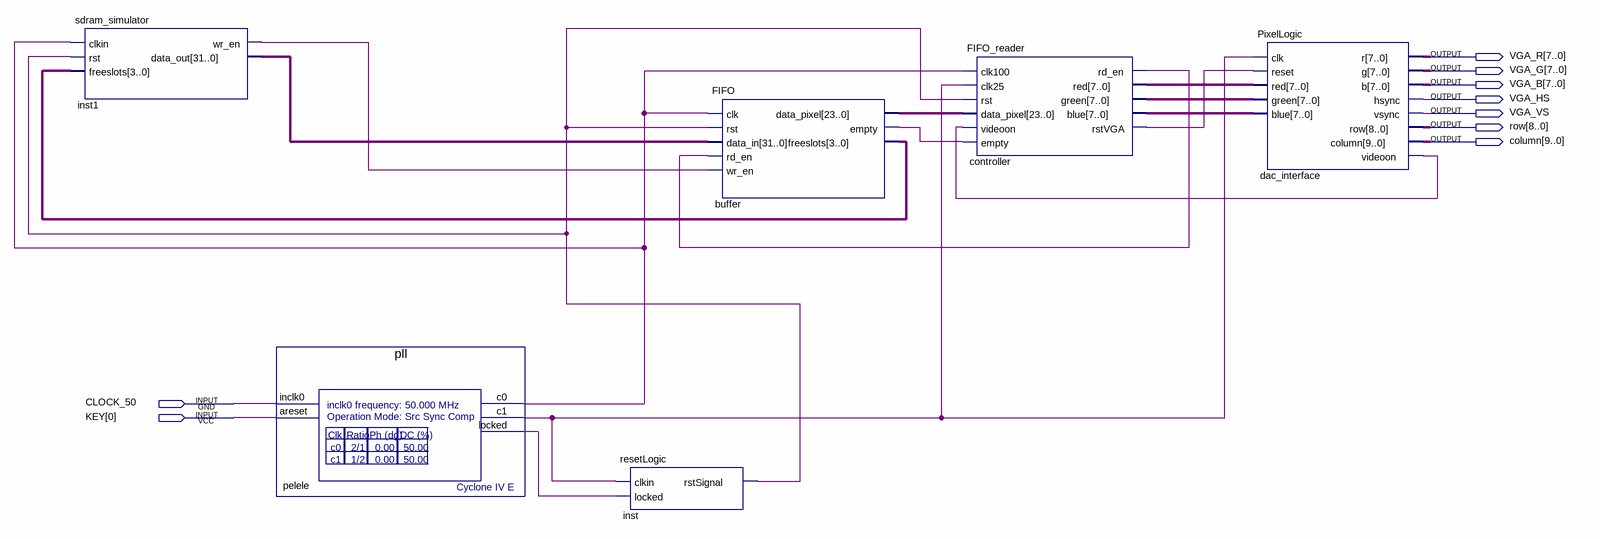
[diagram p0: schematic sheet]
// Quartus schematic symbol_top.bdf as structural Verilog: 6 symbols, 9 pins
module symbol_top (
  input  CLOCK_50,
  input  [0:0] KEY,
  output [7:0] VGA_R,
  output [7:0] VGA_G,
  output [7:0] VGA_B,
  output VGA_HS,
  output VGA_VS,
  output [8:0] row,
  output [9:0] column
);

  wire buffer_empty, controller_rd_en, controller_rstvga, dac_interface_videoon, inst1_wr_en, inst_rstsignal,
       pelele_c0, pelele_c1, pelele_locked;
  wire [3:0] buffer_freeslots;
  wire [7:0] controller_blue, controller_green, controller_red;
  wire [23:0] buffer_data_pixel;
  wire [31:0] inst1_data_out;

  sdram_simulator inst1 (
    .clkin(pelele_c0), .rst(inst_rstsignal), .freeslots(buffer_freeslots), .wr_en(inst1_wr_en),
    .data_out(inst1_data_out));
  pll pelele (.inclk0(CLOCK_50), .areset(KEY[0]), .c0(pelele_c0), .c1(pelele_c1), .locked(pelele_locked));
  resetLogic inst (.clkin(pelele_c1), .locked(pelele_locked), .rstSignal(inst_rstsignal));
  FIFO buffer (
    .clk(pelele_c0), .rst(inst_rstsignal), .data_in(inst1_data_out), .rd_en(controller_rd_en),
    .wr_en(inst1_wr_en), .data_pixel(buffer_data_pixel), .empty(buffer_empty), .freeslots(buffer_freeslots));
  FIFO_reader controller (
    .clk100(pelele_c0), .clk25(pelele_c1), .rst(inst_rstsignal), .data_pixel(buffer_data_pixel),
    .videoon(dac_interface_videoon), .empty(buffer_empty), .rd_en(controller_rd_en), .red(controller_red),
    .green(controller_green), .blue(controller_blue), .rstVGA(controller_rstvga));
  PixelLogic dac_interface (
    .clk(pelele_c1), .reset(controller_rstvga), .red(controller_red), .green(controller_green),
    .blue(controller_blue), .r(VGA_R), .g(VGA_G), .b(VGA_B), .hsync(VGA_HS), .vsync(VGA_VS), .row(row),
    .column(column), .videoon(dac_interface_videoon));
endmodule
